# Altium schematic sheet Vicor Converter 2.SchDoc: Vicor Maxi Converter 2
size A; DrawnBy: Adam Vadala-Roth; Revision: 1.1b; SheetNumber: 1; SheetTotal: 2
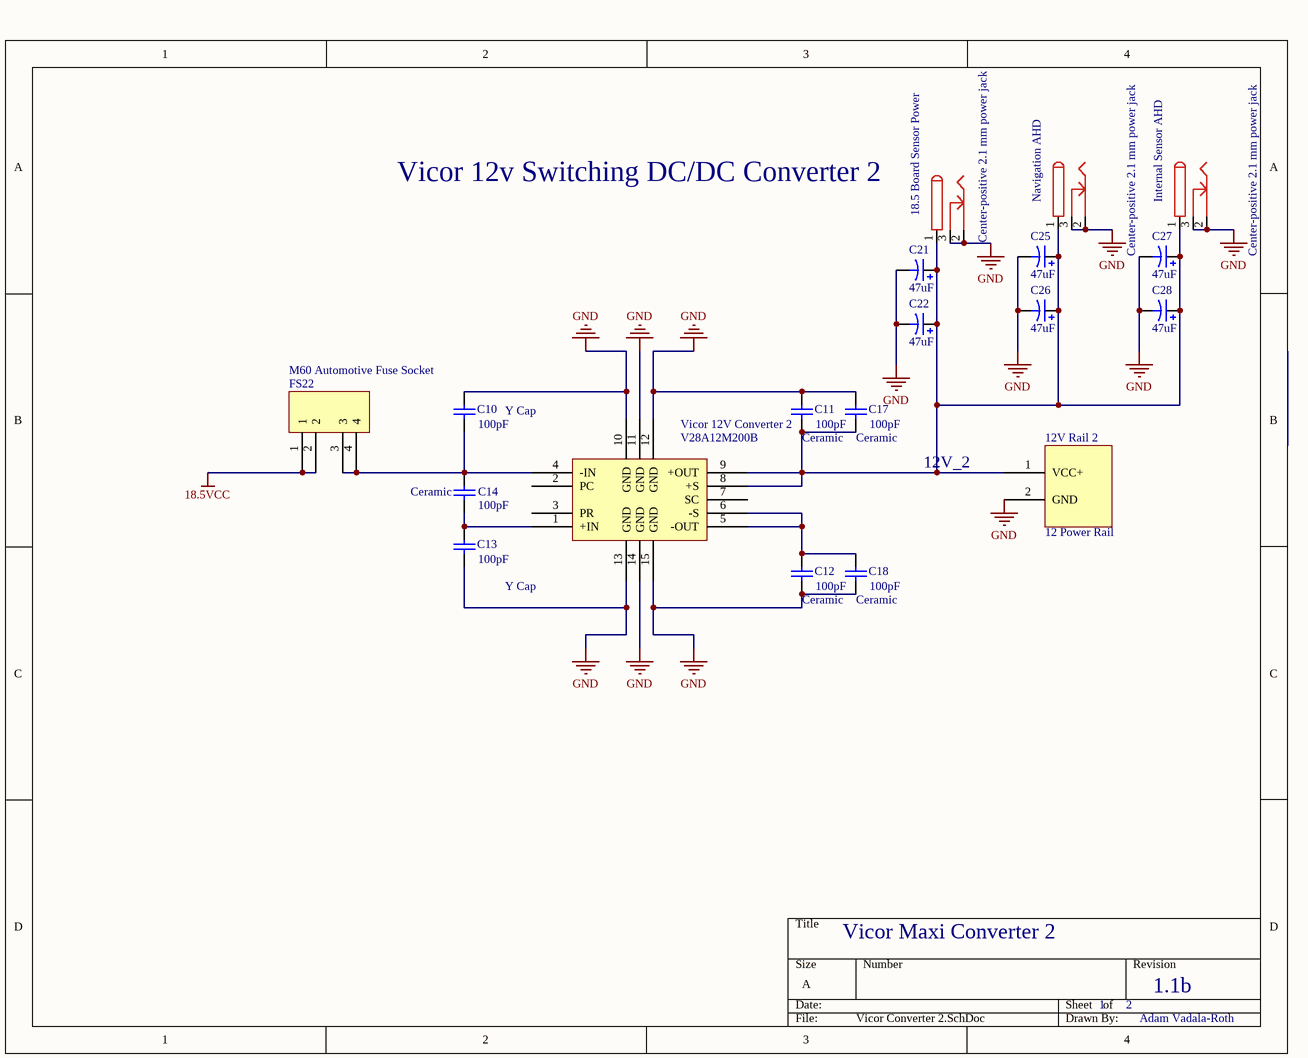
[diagram p0: Vicor Converter 2.SchDoc]

## Parts
12V_Rail_2  12 Power Rail  [Power Rail 12]
18.5_Board_Sensor_Power  Center-positive 2.1 mm power jack  [PJ-102AH]
C10  value 100pF  [CAPRD7.5-12x4.5]  (hidden comment: Cap)
C11  value 100pF  [CAPRD7.5-12x4.5]  (hidden comment: Cap)
C12  value 100pF  [CAPRD7.5-12x4.5]  (hidden comment: Cap)
C13  value 100pF  [CAPRD7.5-12x4.5]  (hidden comment: Cap)
C14  value 100pF  [Vicor AC CAP 0.22uF 250VAC]  (hidden comment: Cap)
C17  value 100pF  [CAPRD7.5-12x4.5]  (hidden comment: Cap)
C18  value 100pF  [CAPRD7.5-12x4.5]  (hidden comment: Cap)
C21  value 47uF  [CAPPR2.5-6.3x5]  (hidden comment: Cap Pol1)
C22  value 47uF  [CAPPR2.5-6.3x5]  (hidden comment: Cap Pol1)
C25  value 47uF  [CAPPR2.5-6.3x5]  (hidden comment: Cap Pol1)
C26  value 47uF  [CAPPR2.5-6.3x5]  (hidden comment: Cap Pol1)
C27  value 47uF  [CAPPR2.5-6.3x5]  (hidden comment: Cap Pol1)
C28  value 47uF  [CAPPR2.5-6.3x5]  (hidden comment: Cap Pol1)
FS22  M60 Automotive Fuse Socket  [M60]
Internal_Sensor_AHD  Center-positive 2.1 mm power jack  [PJ-102AH]
Navigation_AHD  Center-positive 2.1 mm power jack  [PJ-102AH]
Vicor_12V_Converter_2  V28A12M200B  [Vicor Maxi DC DC Converter]

## Nets
18.5VCC: FS22.1 FS22.2
GND: 12V_Rail_2.2(GND) 18.5_Board_Sensor_Power.2 18.5_Board_Sensor_Power.3 C10.2 C11.2 C12.1 C13.1 C17.2 C18.1 C21.2 C22.2 C25.2 C26.2 C27.2 C28.2 Internal_Sensor_AHD.2 Internal_Sensor_AHD.3 Navigation_AHD.2 Navigation_AHD.3 Vicor_12V_Converter_2.10(GND) Vicor_12V_Converter_2.11(GND) Vicor_12V_Converter_2.12(GND) Vicor_12V_Converter_2.13(GND) Vicor_12V_Converter_2.14(GND) Vicor_12V_Converter_2.15(GND)
Net12V_Rail_2_1: 12V_Rail_2.1(VCC+) 18.5_Board_Sensor_Power.1 C11.1 C17.1 C21.1 C22.1 C25.1 C26.1 C27.1 C28.1 Internal_Sensor_AHD.1 Navigation_AHD.1 Vicor_12V_Converter_2.8(+S) Vicor_12V_Converter_2.9(+OUT)
NetC10_1: C10.1 C14.2 FS22.3 FS22.4 Vicor_12V_Converter_2.4(-IN)
NetC12_2: C12.2 C18.2 Vicor_12V_Converter_2.5(-OUT) Vicor_12V_Converter_2.6(-S)
NetC13_2: C13.2 C14.1 Vicor_12V_Converter_2.1(+IN)

Not connected (* = marked no-connect by the designer): Vicor_12V_Converter_2 2(PC) 3(PR) 7(SC)

## Notes on the sheet
- (near 18.5_Board_Sensor_Power) Vicor 12v Switching DC/DC Converter 2
- Y Cap
- Ceramic
- (near C17) Ceramic
- 12V_2
- (near C14) Ceramic
- (near C18) Ceramic

## Library data of the parts
18.5_Board_Sensor_Power Internal_Sensor_AHD Navigation_AHD = PWR2.5: Power jack; Published: 17-Dec-2003; DatasheetDocument: 09-May-2002; Publisher: Altium Limited; ComponentLink1Description: Manufacturer Link; ComponentLink1URL: http://domino.kycon.com/internet/Products.html
C10-C14 C17 C18 = Cap: Capacitor; Published: 8-Jun-2000; LatestRevisionDate: 17-Jul-2002; LatestRevisionNote: Re-released for DXP Platform.; PackageReference: RAD-0.3; Publisher: Altium Limited; PackageDescription: Radial Cap, Thru-Hole; 2 Leads; 0.3 in Pin Spacing
C21 C22 C25-C28 = Cap Pol1: Polarized Capacitor (Radial); Published: 8-Jun-2000; LatestRevisionDate: 17-Jul-2002; LatestRevisionNote: Re-released for DXP Platform.; PackageReference: RB7.6-15; Publisher: Altium Limited; PackageDescription: Polarized Capacitor (Radial); 2 Leads
FS22 = M60 Automotive Fuse: Automotive Fuse Socket
Vicor_12V_Converter_2 = V28A12M200B: V28A12M200B 12V DC/DC Converter